# EasyEDA Pro project 鱼缸控制器(e-ink).epro, schematic epad_c01_0603

## Sheets
1 Epad_C01_0603: Board Name: Epad_C01_0603_ascii; Create Date: 2024-12-20; Page Name: Epad_C01_0603_ascii; Project Name: 鱼缸控制器(e-ink); Schematic Name: epad_c01_0603_ascii; Update Date: 2024-12-20
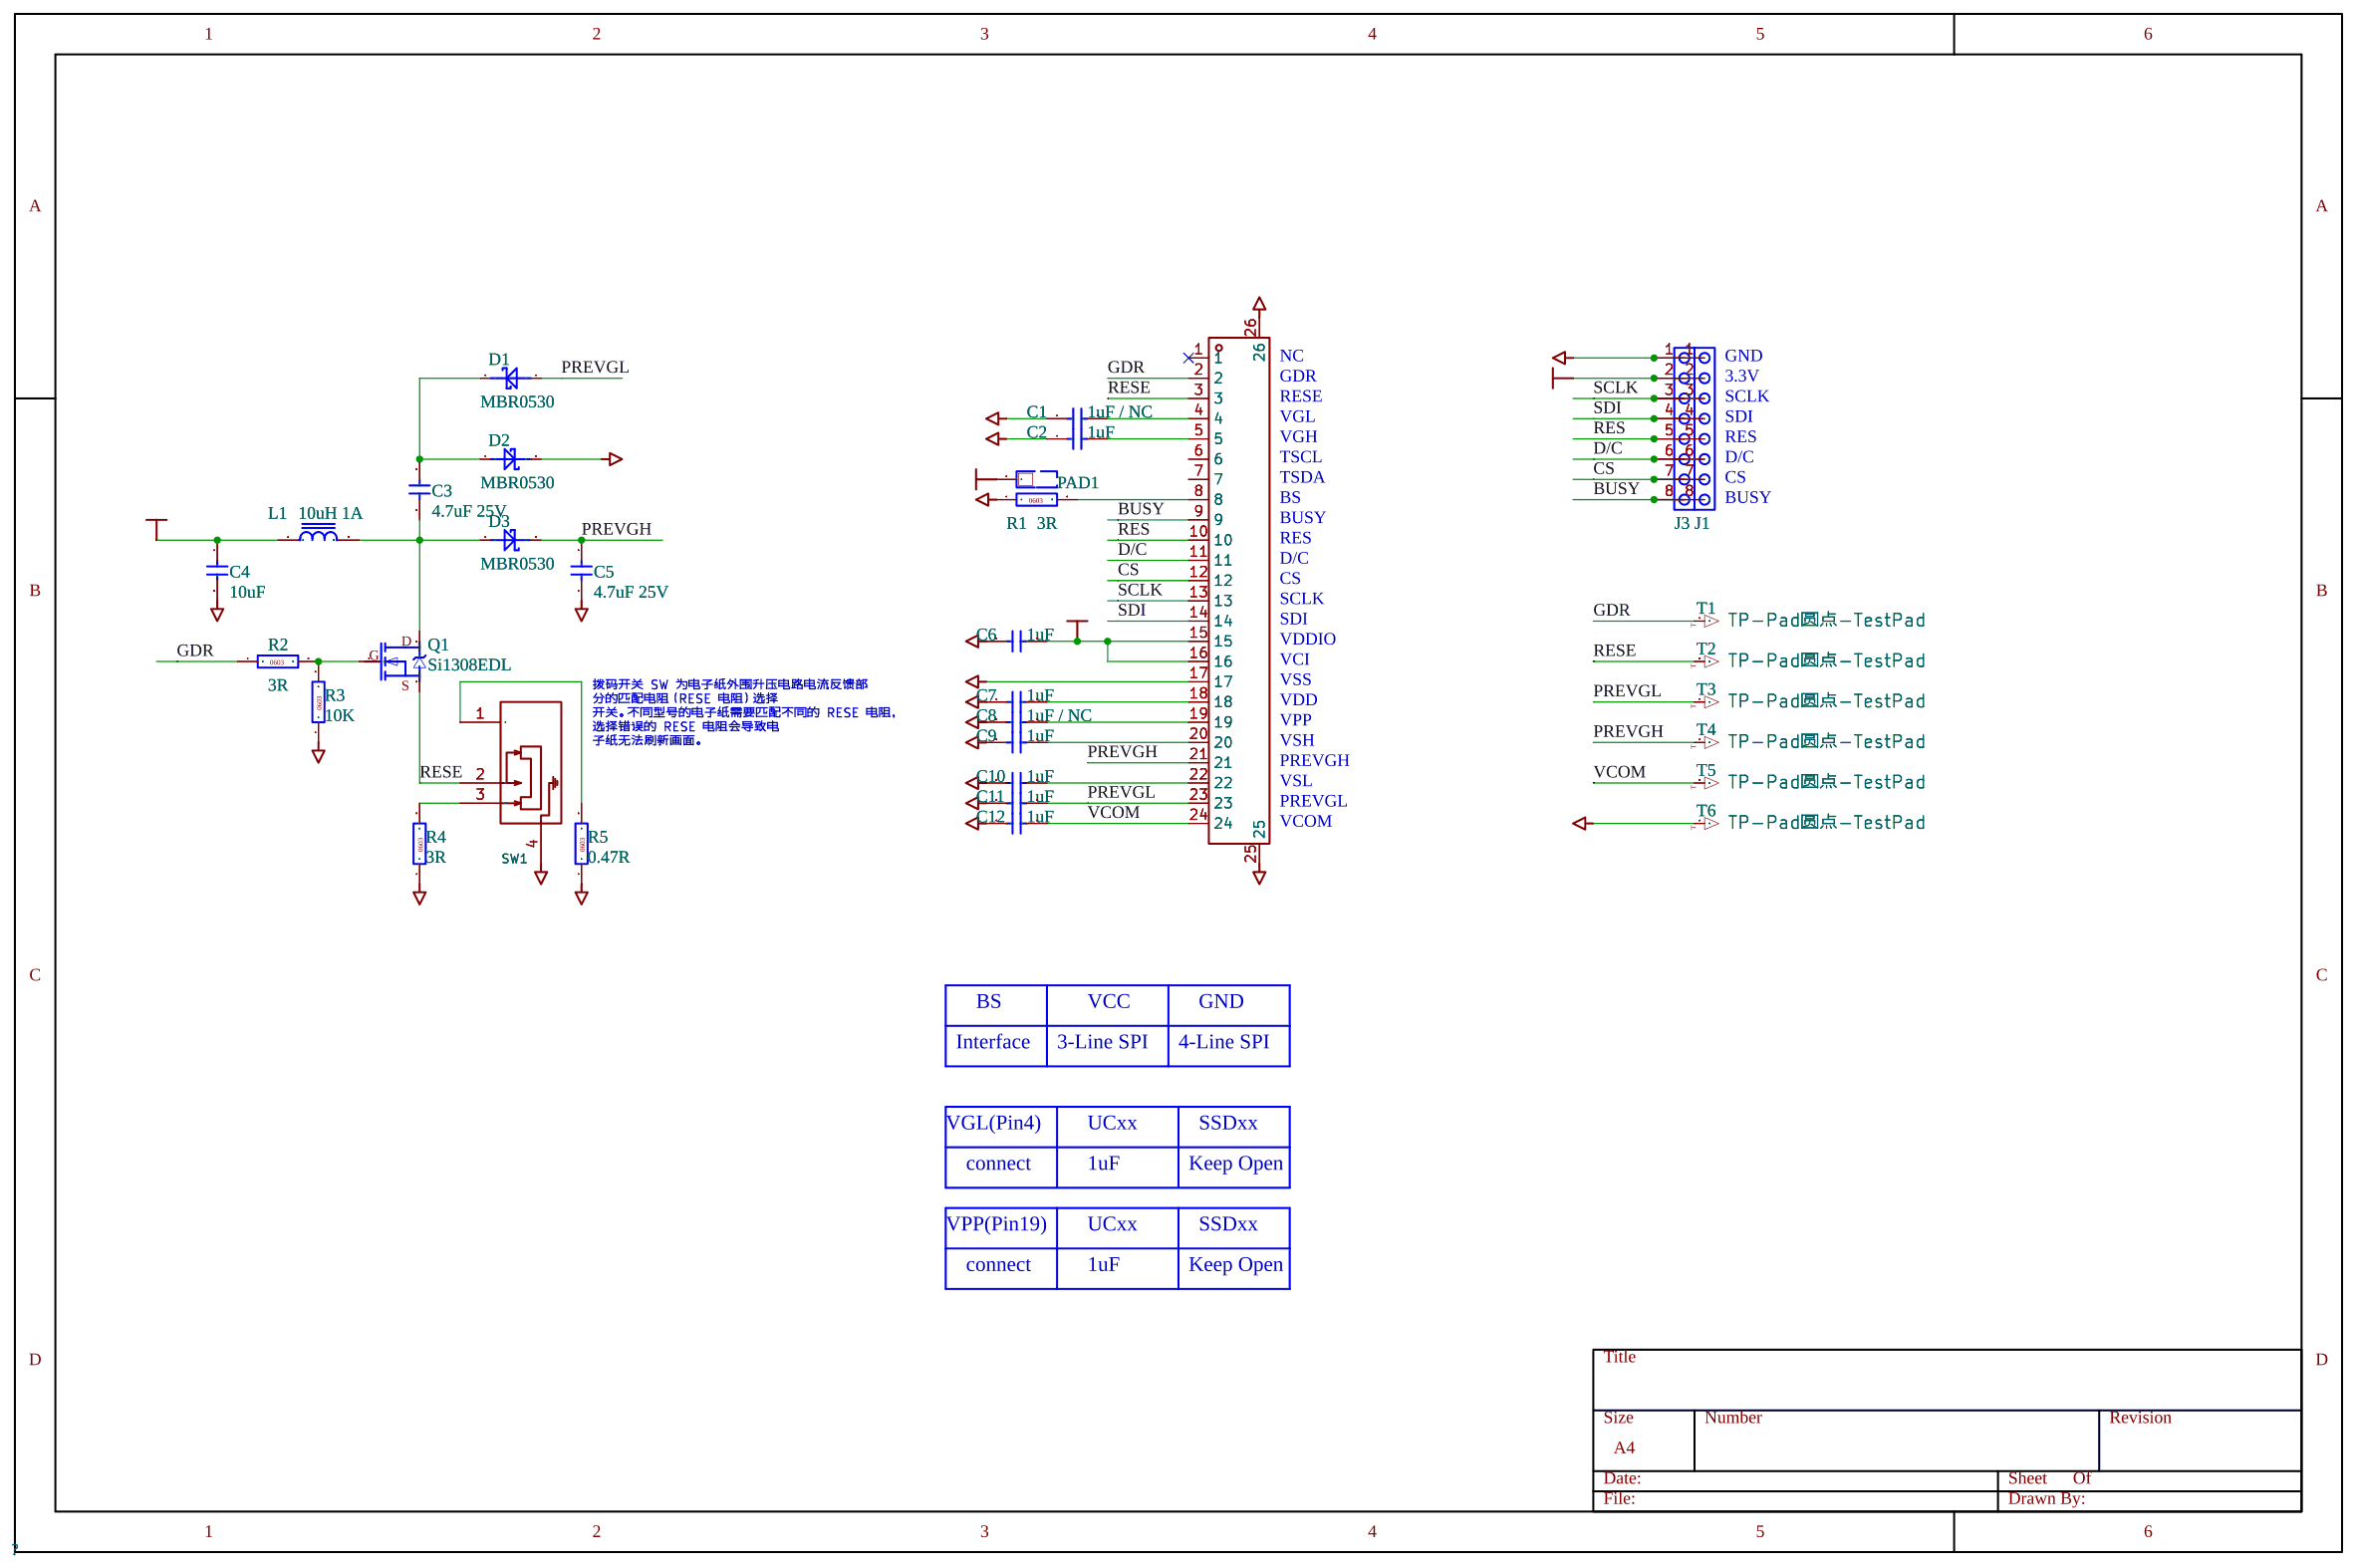
[diagram p2: Epad_C01_0603]
2 历史和备忘: Page Name: 历史和备忘_ascii
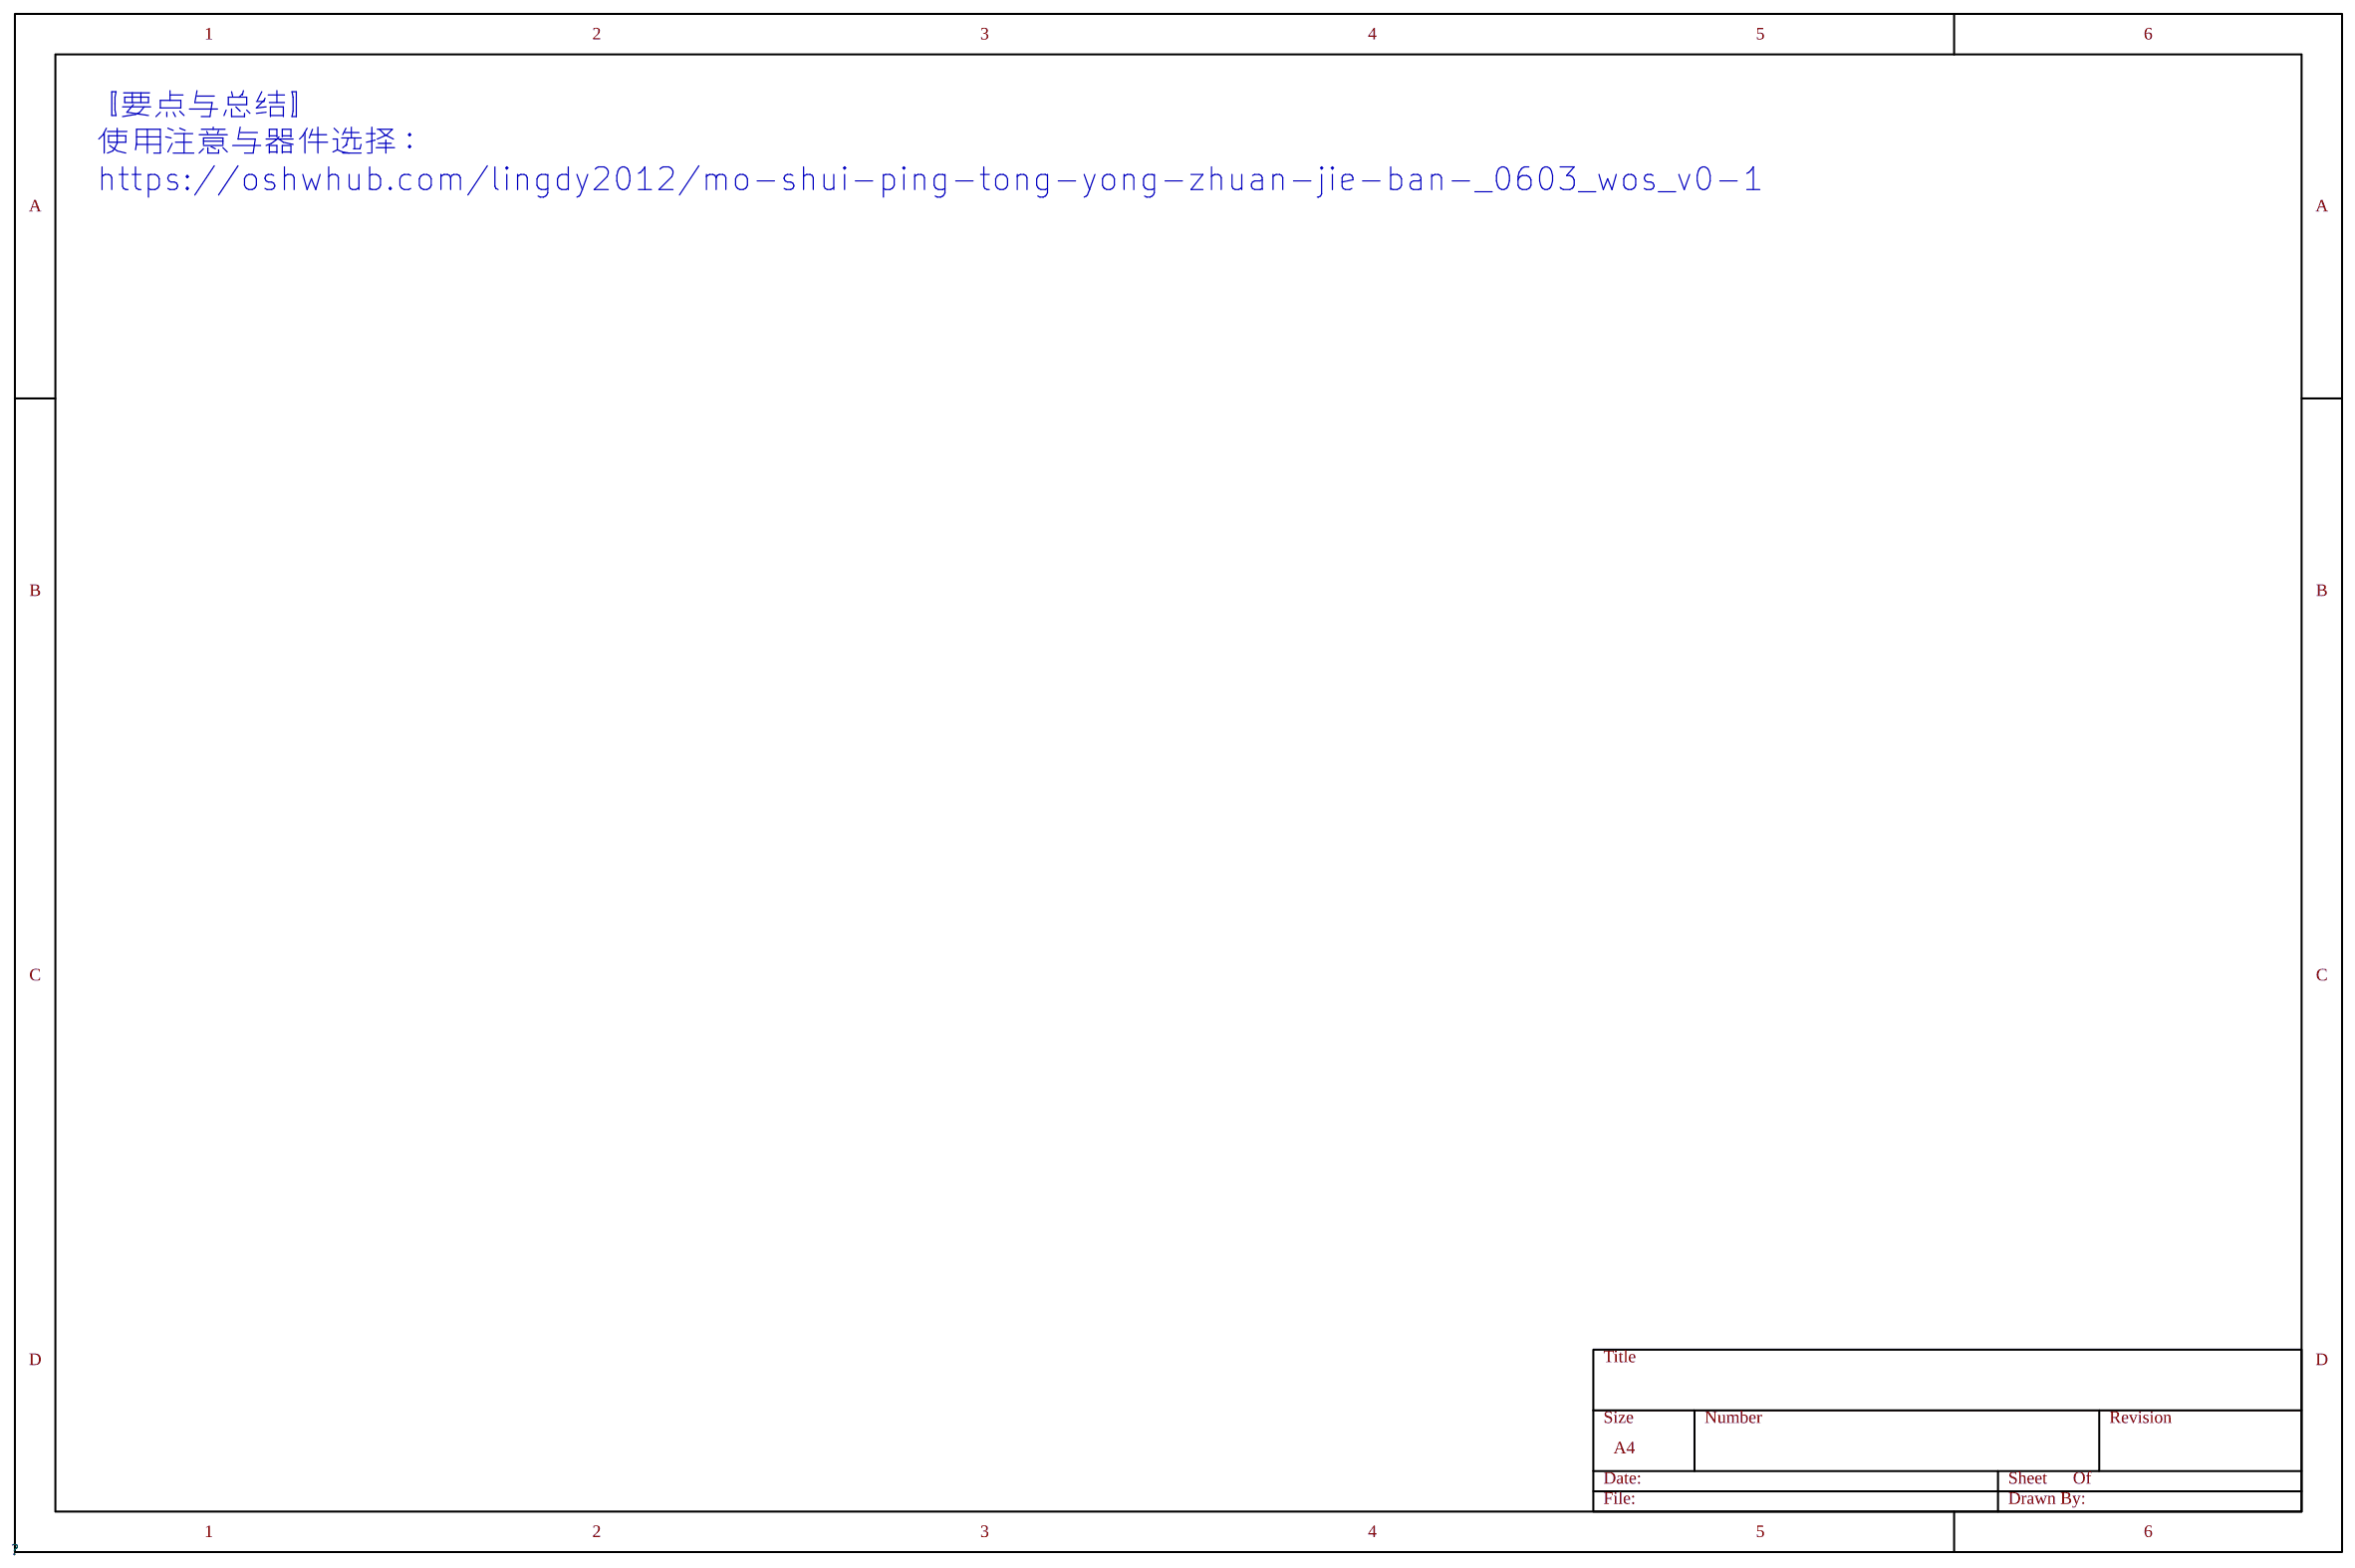
[diagram p3: 历史和备忘]

## Parts
C1  1uF / NC  [C_մƬ(MLCC)_0603]
C2  1uF  [C_մƬ(MLCC)_0603]
C3  4.7uF 25V  [C_մƬ(MLCC)_0805]
C4  10uF  [C_մƬ(MLCC)_0603]
C5  4.7uF 25V  [C_մƬ(MLCC)_0805]
C6  1uF  [C_մƬ(MLCC)_0603]
C7  1uF  [C_մƬ(MLCC)_0603]
C8  1uF / NC  [C_մƬ(MLCC)_0603]
C9  1uF  [C_մƬ(MLCC)_0603]
C10  1uF  [C_մƬ(MLCC)_0603]
C11  1uF  [C_մƬ(MLCC)_0603]
C12  1uF  [C_մƬ(MLCC)_0603]
CN1  CN_FPC_24P  [CN_FPC_24P_0.5MM_½]
D1  MBR0530  [SOD-323]
D2  MBR0530  [SOD-323]
D3  MBR0530  [SOD-323]
J1  单排排针  [J__2.54_8x1P_SMD_]
J3  单排排针  [J__2.54_8x1P_SMD_]
L1  10uH 1A  [L_΢͹_2.5*2.0*1.2MM]
PAD1  0603  [Pad_ߺ_0603]
Q1  Si1308EDL  [SOT23-3(BHC)]
R1  3R  [R_Ƭ_0603]
R2  3R  [R_Ƭ_0603]
R3  10K  [R_Ƭ_0603]
R4  3R  [R_Ƭ_0603]
R5  0.47R  [R_Ƭ_0603]
SW1  SW_拨动开关_1P侧拨_SMD  [SW_ದ_SMD_MSK12CO2-SZ]
T1  TP-Pad圆点-TestPad  [TP-PadԲ_1.2_˿ӡ]
T2  TP-Pad圆点-TestPad  [TP-PadԲ_1.2_˿ӡ]
T3  TP-Pad圆点-TestPad  [TP-PadԲ_1.2_˿ӡ]
T4  TP-Pad圆点-TestPad  [TP-PadԲ_1.2_˿ӡ]
T5  TP-Pad圆点-TestPad  [TP-PadԲ_1.2_˿ӡ]
T6  TP-Pad圆点-TestPad  [TP-PadԲ_1.2_˿ӡ]

## Library data of the parts
C1 C8 = 1uF / NC: 多层片式陶瓷电容器(MLCC); 通识名称: 贴片电容; 通识封装: 0603; Origin Footprint 2: C_陶瓷贴片(MLCC)_2225; Origin Footprint 3: C_陶瓷贴片(MLCC)_1825; Origin Footprint 4: C_陶瓷贴片(MLCC)_1812; Origin Footprint 5: C_陶瓷贴片(MLCC)_1808; Origin Footprint 6: C_陶瓷贴片(MLCC)_1210; Origin Footprint 7: C_陶瓷贴片(MLCC)_1206; Origin Footprint 8: C_陶瓷贴片(MLCC)_0805; Origin Footprint 9: C_陶瓷贴片(MLCC)_0402; Origin Footprint 10: C_陶瓷贴片(MLCC)_0201; Origin Footprint 1: C_陶瓷贴片(MLCC)_0603; Design Item ID: C_陶瓷贴片(MLCC); Library Name: 1.4 电容类
C2 C6 C7 C9-C12 = 1uF: 多层片式陶瓷电容器(MLCC); 通识名称: 贴片电容; 通识封装: 0603; Origin Footprint 2: C_陶瓷贴片(MLCC)_2225; Origin Footprint 3: C_陶瓷贴片(MLCC)_1825; Origin Footprint 4: C_陶瓷贴片(MLCC)_1812; Origin Footprint 5: C_陶瓷贴片(MLCC)_1808; Origin Footprint 6: C_陶瓷贴片(MLCC)_1210; Origin Footprint 7: C_陶瓷贴片(MLCC)_1206; Origin Footprint 8: C_陶瓷贴片(MLCC)_0805; Origin Footprint 9: C_陶瓷贴片(MLCC)_0402; Origin Footprint 10: C_陶瓷贴片(MLCC)_0201; Origin Footprint 1: C_陶瓷贴片(MLCC)_0603; Design Item ID: C_陶瓷贴片(MLCC); Library Name: 1.4 电容类
C3 C5 = 4.7uF 25V: 多层片式陶瓷电容器(MLCC); 通识名称: 贴片电容; 通识封装: 0805; Origin Footprint 2: C_陶瓷贴片(MLCC)_2225; Origin Footprint 3: C_陶瓷贴片(MLCC)_1825; Origin Footprint 4: C_陶瓷贴片(MLCC)_1812; Origin Footprint 5: C_陶瓷贴片(MLCC)_1808; Origin Footprint 6: C_陶瓷贴片(MLCC)_1210; Origin Footprint 7: C_陶瓷贴片(MLCC)_1206; Origin Footprint 8: C_陶瓷贴片(MLCC)_0603; Origin Footprint 9: C_陶瓷贴片(MLCC)_0402; Origin Footprint 10: C_陶瓷贴片(MLCC)_0201; Origin Footprint 1: C_陶瓷贴片(MLCC)_0805; Design Item ID: C_陶瓷贴片(MLCC); Library Name: 1.4 电容类
C4 = 10uF: 多层片式陶瓷电容器(MLCC); 通识名称: 贴片电容; 通识封装: 0603; Origin Footprint 2: C_陶瓷贴片(MLCC)_2225; Origin Footprint 3: C_陶瓷贴片(MLCC)_1825; Origin Footprint 4: C_陶瓷贴片(MLCC)_1812; Origin Footprint 5: C_陶瓷贴片(MLCC)_1808; Origin Footprint 6: C_陶瓷贴片(MLCC)_1210; Origin Footprint 7: C_陶瓷贴片(MLCC)_1206; Origin Footprint 8: C_陶瓷贴片(MLCC)_0805; Origin Footprint 9: C_陶瓷贴片(MLCC)_0402; Origin Footprint 10: C_陶瓷贴片(MLCC)_0201; Origin Footprint 1: C_陶瓷贴片(MLCC)_0603; Design Item ID: C_陶瓷贴片(MLCC); Library Name: 1.4 电容类
CN1 = CN_FPC_24P: FPC连接器,24P; 通识封装: FPC连接器,0.5mm,24P，翻盖上下接; 通识名称: FPC连接器; Library Name: 10.4 FPC连接器
D1-D3 = MBR0530: 肖特基二极管,40V 1A 600mV@1A; 通识名称: 二极管; Design Item ID: D_肖特基_1A_1N5819WS; Library Name: 2.1 二极管类
J1 = 单排排针: 8P接插件; 通识封装: 排针 8P; Origin Footprint 2: HDR-1X8; Origin Footprint 3: HDR-1X8_M; Origin Footprint 4: XH2.54-8P; Origin Footprint 5: VH3.96-8P_H; Origin Footprint 6: VH3.96-8P; Origin Footprint 7: KF2510-8P; Origin Footprint 8: XH2.54-8P_H; Origin Footprint 9: HDR-1X8_Y; Origin Footprint 10: HDR-1X8_H; Origin Footprint 11: KF301-8P; Origin Footprint 12: KF2EDGK5.0-8P; Origin Footprint 13: PH2.0 D-L-8P; Origin Footprint 14: PH2.0 D-W-8P; Origin Footprint 15: KF2EDGK5.0-8P_H; Origin Footprint 16: KF7620-8P; Origin Footprint 17: KF350-8P; Origin Footprint 18: KF128-3.81-8P; Origin Footprint 19: KF128-5.08-8P; Origin Footprint 20: PH2.0 S-W-8P; Origin Footprint 21: KF2EDGK5.08-8P; Origin Footprint 22: KF2EDGK5.08-8P_H; Origin Footprint 23: HDR2.54 S-W-8P; Origin Footprint 24: HDR2.54 S-W-8P_M; Origin Footprint 25: HDR-1X8(Pad_RR_1.4*1.6); Origin Footprint 1: J_排针_2.54_8x1P_SMD_卧贴; Design Item ID: J_Header_8; Library Name: 10.1 排针、排母
J3 = 单排排针: 8P接插件; 通识封装: 排针 8P; Origin Footprint 2: HDR-1X8; Origin Footprint 3: HDR-1X8_M; Origin Footprint 4: XH2.54-8P; Origin Footprint 5: VH3.96-8P_H; Origin Footprint 6: VH3.96-8P; Origin Footprint 7: KF2510-8P; Origin Footprint 8: XH2.54-8P_H; Origin Footprint 9: HDR-1X8_Y; Origin Footprint 10: HDR-1X8_H; Origin Footprint 11: KF301-8P; Origin Footprint 12: KF2EDGK5.0-8P; Origin Footprint 13: PH2.0 D-L-8P; Origin Footprint 14: PH2.0 D-W-8P; Origin Footprint 15: KF2EDGK5.0-8P_H; Origin Footprint 16: KF7620-8P; Origin Footprint 17: KF350-8P; Origin Footprint 18: KF128-3.81-8P; Origin Footprint 19: KF128-5.08-8P; Origin Footprint 20: PH2.0 S-W-8P; Origin Footprint 21: KF2EDGK5.08-8P; Origin Footprint 22: KF2EDGK5.08-8P_H; Origin Footprint 23: HDR2.54 S-W-8P; Origin Footprint 24: HDR2.54 S-W-8P_M; Origin Footprint 25: J_排针_2.54_8x1P_SMD_卧贴; Origin Footprint 1: HDR-1X8(Pad_RR_1.4*1.6); Design Item ID: J_Header_8; Library Name: 10.1 排针、排母
L1 = 10uH 1A: 微型功率电感; Date: 12302002; 通识名称: 微型功率电感; 通识封装: SMD,2.5*2.0*1.2mm; Design Item ID: L_微型功率; Library Name: 1.5 电感磁珠类
PAD1 = 0603: 单边焊盘，方形; 通识封装: 略; 通识名称: 焊盘; Design Item ID: Pad_单边焊盘; Library Name: 0.00 工程积累(待分类)
Q1 = Si1308EDL: N沟道场效应管 30V 1.4A; 通识名称: N沟道MOSFET; 通识封装: SOT23; Origin Footprint 2: SOT23-3N; Origin Footprint 3: SOT23-3L; Origin Footprint 4: SOT23-3M; Origin Footprint 5: SOT23-3_GSD; Design Item ID: FET_N沟道_Si1308EDL; Library Name: 2.3 场效应管类
R1 R2 R4 = 3R: 5%, 1/10W, 定值贴片, 0603封装; 通识名称: 贴片电阻; 通识封装: 0603; Design Item ID: R_贴片_0603; Library Name: 1.1 电阻(常规)
R3 = 10K: 5%, 1/10W, 定值贴片, 0603封装; 通识名称: 贴片电阻; 通识封装: 0603; Design Item ID: R_贴片_0603; Library Name: 1.1 电阻(常规)
R5 = 0.47R: 5%, 1/10W, 定值贴片, 0603封装; 通识名称: 贴片电阻; 通识封装: 0603; Design Item ID: R_贴片_0603; Library Name: 1.1 电阻(常规)
SW1 = SW_拨动开关_1P侧拨_SMD: 单联侧拨(贴片); 通识封装: 单联侧拨(贴片); 通识名称: 拨动开关; Origin Footprint 1: SW_单联侧拨_SMD_MSK12CO2-SZ; Library Name: 3.1 开关按键类
T1-T6 = TP-Pad圆点-TestPad: 测试点; Origin Footprint 2: TP-Pad圆点_1.0; Origin Footprint 3: TP-Pad圆点_1.0_无丝印; Origin Footprint 4: TP-Pad圆点_1.2; Origin Footprint 5: TP-Pad圆点_1.4; Origin Footprint 6: TP-Pad圆点_1.4_无丝印; Origin Footprint 7: TP-Pad圆点_1.6; Origin Footprint 8: TP-Pad圆点_1.6_无丝印; Origin Footprint 9: TP-Pad圆点_1.8; Origin Footprint 10: TP-Pad圆点_1.8_无丝印; Origin Footprint 1: TP-Pad圆点_1.2_无丝印; Library Name: 11.3 测试点与识别点类

## Nets
GND: C1.1 C2.1 C4.2 C5.1 C6.2 C7.2 C8.2 C9.2 C10.2 C11.2 C12.2 CN1.17 CN1.25 CN1.26 D2.2(K) J1.1 J3.1 R1.1 R3.1 R4.1 R5.1 SW1.4 T6.1
VCC3.3: C4.1 C6.1 CN1.15 CN1.16 J1.2 J3.2 L1.1 PAD1.1
BUSY: CN1.9 J1.8 J3.8
CS: CN1.12 J1.7 J3.7
D/C: CN1.11 J1.6 J3.6
GDR: CN1.2 R2.1 T1.1
PREVGH: C5.2 CN1.21 D3.2(K) T4.1
PREVGL: C11.1 CN1.23 D1.1(A) T3.1
RES: CN1.10 J1.5 J3.5
RESE: CN1.3 Q1.2(S) SW1.2 T2.1
SCLK: CN1.13 J1.3 J3.3
SDI: CN1.14 J1.4 J3.4
VCOM: C12.1 CN1.24 T5.1
NETC1_2: C1.2 CN1.4
NETC2_2: C2.2 CN1.5
NETC3_1: C3.1 D1.2(K) D2.1(A)
NETC3_2: C3.2 D3.1(A) L1.2 Q1.3(D)
NETC7_1: C7.1 CN1.18
NETC8_1: C8.1 CN1.19
NETC9_1: C9.1 CN1.20
NETC10_1: C10.1 CN1.22
NETCN1_8: CN1.8 R1.2
NETQ1_1: Q1.1(G) R2.2 R3.2
NETR4_2: R4.2 SW1.3
NETR5_2: R5.2 SW1.1

Not connected (* = marked no-connect by the designer): CN1 1* 6 7

## Notes on the sheets
sheet 1
- NC
- GND
- GDR
- 3.3V
- RESE
- VGL
- SCLK
- SDI
- VGH
- RES
- TSCL
- D/C
- TSDA
- CS
- BS
- BUSY
- BUSY
- RES
- D/C
- CS
- SCLK
- SDI
- VDDIO
- 拨码开关 SW 为电子纸外围升压电路电流反馈部
  分的匹配电阻（RESE 电阻）选择
  开关。不同型号的电子纸需要匹配不同的 RESE 电阻，
  选择错误的 RESE 电阻会导致电
  子纸无法刷新画面。
- VCI
- VSS
- VDD
- VPP
- VSH
- PREVGH
- PREVGL
- VSL
- VCOM
- BS
- VCC
- GND
- Interface
- 3-Line SPI
- 4-Line SPI
- VGL(Pin4)
- UCxx
- SSDxx
- connect
- 1uF
- Keep Open
- VPP(Pin19)
- UCxx
- SSDxx
- connect
- 1uF
- Keep Open
sheet 2
- 【要点与总结】
  使用注意与器件选择：
  https://oshwhub.com/lingdy2012/mo-shui-ping-tong-yong-zhuan-jie-ban-_0603_wos_v0-1
